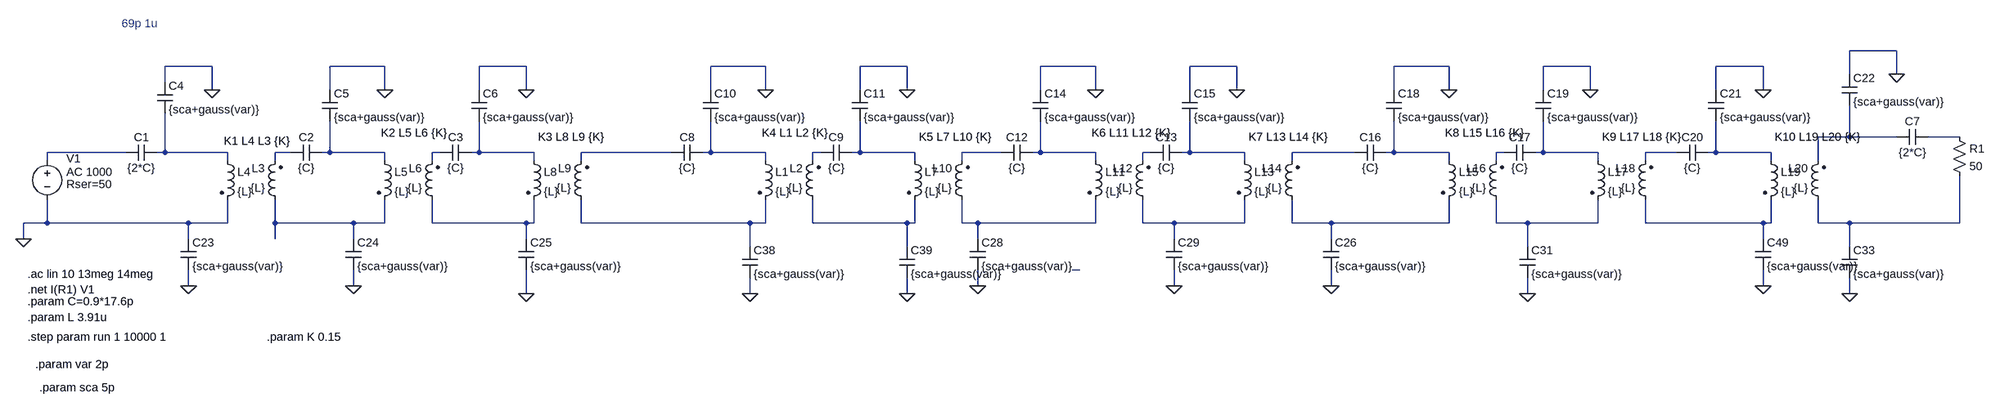
[diagram p0: schematic changeCvalue.asc]
changeCvalue.asc, the LTspice schematic file:
Version 4
SHEET 1 1260 680
WIRE 1072 -80 976 -80
WIRE -2368 -48 -2464 -48
WIRE -2016 -48 -2128 -48
WIRE -1728 -48 -1824 -48
WIRE -1232 -48 -1344 -48
WIRE -944 -48 -1040 -48
WIRE -560 -48 -672 -48
WIRE -272 -48 -368 -48
WIRE 160 -48 48 -48
WIRE 448 -48 352 -48
WIRE 800 -48 704 -48
WIRE 976 -32 976 -80
WIRE 1072 -32 1072 -80
WIRE -2464 -16 -2464 -48
WIRE -2368 0 -2368 -48
WIRE -2128 0 -2128 -48
WIRE -2016 0 -2016 -48
WIRE -1824 0 -1824 -48
WIRE -1728 0 -1728 -48
WIRE -1344 0 -1344 -48
WIRE -1232 0 -1232 -48
WIRE -1040 0 -1040 -48
WIRE -944 0 -944 -48
WIRE -672 0 -672 -48
WIRE -560 0 -560 -48
WIRE -368 0 -368 -48
WIRE -272 0 -272 -48
WIRE 48 0 48 -48
WIRE 160 0 160 -48
WIRE 352 0 352 -48
WIRE 448 0 448 -48
WIRE 704 0 704 -48
WIRE 800 0 800 -48
WIRE 976 96 976 32
WIRE 976 96 912 96
WIRE 1072 96 976 96
WIRE 1200 96 1136 96
WIRE -2544 128 -2704 128
WIRE -2464 128 -2464 48
WIRE -2464 128 -2480 128
WIRE -2336 128 -2464 128
WIRE -2208 128 -2240 128
WIRE -2128 128 -2128 64
WIRE -2128 128 -2144 128
WIRE -2016 128 -2128 128
WIRE -1904 128 -1920 128
WIRE -1824 128 -1824 64
WIRE -1824 128 -1840 128
WIRE -1712 128 -1824 128
WIRE -1424 128 -1616 128
WIRE -1344 128 -1344 64
WIRE -1344 128 -1360 128
WIRE -1232 128 -1344 128
WIRE -1120 128 -1136 128
WIRE -1040 128 -1040 64
WIRE -1040 128 -1056 128
WIRE -928 128 -1040 128
WIRE -752 128 -832 128
WIRE -672 128 -672 64
WIRE -672 128 -688 128
WIRE -560 128 -672 128
WIRE -448 128 -464 128
WIRE -368 128 -368 64
WIRE -368 128 -384 128
WIRE -256 128 -368 128
WIRE -32 128 -160 128
WIRE 48 128 48 64
WIRE 48 128 32 128
WIRE 160 128 48 128
WIRE 272 128 256 128
WIRE 352 128 352 64
WIRE 352 128 336 128
WIRE 464 128 352 128
WIRE 624 128 560 128
WIRE 704 128 704 64
WIRE 704 128 688 128
WIRE 816 128 704 128
WIRE -2704 144 -2704 128
WIRE -2336 144 -2336 128
WIRE -2240 144 -2240 128
WIRE -2016 144 -2016 128
WIRE -1920 144 -1920 128
WIRE -1712 144 -1712 128
WIRE -1616 144 -1616 128
WIRE -1232 144 -1232 128
WIRE -1136 144 -1136 128
WIRE -928 144 -928 128
WIRE -832 144 -832 128
WIRE -560 144 -560 128
WIRE -464 144 -464 128
WIRE -256 144 -256 128
WIRE -160 144 -160 128
WIRE 160 144 160 128
WIRE 256 144 256 128
WIRE 464 144 464 128
WIRE 560 144 560 128
WIRE 816 144 816 128
WIRE 912 144 912 96
WIRE -2704 272 -2704 224
WIRE -2704 272 -2752 272
WIRE -2416 272 -2704 272
WIRE -2336 272 -2336 224
WIRE -2336 272 -2416 272
WIRE -2240 272 -2240 224
WIRE -2080 272 -2240 272
WIRE -2016 272 -2016 224
WIRE -2016 272 -2080 272
WIRE -1920 272 -1920 224
WIRE -1728 272 -1920 272
WIRE -1712 272 -1712 224
WIRE -1712 272 -1728 272
WIRE -1616 272 -1616 224
WIRE -1264 272 -1616 272
WIRE -1232 272 -1232 224
WIRE -1232 272 -1264 272
WIRE -1136 272 -1136 224
WIRE -944 272 -1136 272
WIRE -928 272 -928 224
WIRE -928 272 -944 272
WIRE -832 272 -832 224
WIRE -800 272 -832 272
WIRE -560 272 -560 224
WIRE -560 272 -800 272
WIRE -464 272 -464 224
WIRE -400 272 -464 272
WIRE -256 272 -256 224
WIRE -256 272 -400 272
WIRE -160 272 -160 224
WIRE -80 272 -160 272
WIRE 160 272 160 224
WIRE 160 272 -80 272
WIRE 256 272 256 224
WIRE 320 272 256 272
WIRE 464 272 464 224
WIRE 464 272 320 272
WIRE 560 272 560 224
WIRE 800 272 560 272
WIRE 816 272 816 224
WIRE 816 272 800 272
WIRE 912 272 912 224
WIRE 976 272 912 272
WIRE 1200 272 1200 176
WIRE 1200 272 976 272
WIRE -2752 304 -2752 272
WIRE -2416 304 -2416 272
WIRE -2240 304 -2240 272
WIRE -2080 304 -2080 272
WIRE -1728 304 -1728 272
WIRE -800 304 -800 272
WIRE -400 304 -400 272
WIRE -80 304 -80 272
WIRE 800 304 800 272
WIRE -1264 320 -1264 272
WIRE -944 320 -944 272
WIRE 320 320 320 272
WIRE 976 320 976 272
WIRE -592 368 -608 368
WIRE -2416 400 -2416 368
WIRE -2080 400 -2080 368
WIRE -800 400 -800 368
WIRE -400 400 -400 368
WIRE -80 400 -80 368
WIRE 800 400 800 368
WIRE -1728 416 -1728 368
WIRE -1264 416 -1264 384
WIRE -944 416 -944 384
WIRE 320 416 320 384
WIRE 976 416 976 384
FLAG -2752 304 0
FLAG -2368 0 0
FLAG -2016 0 0
FLAG -1728 0 0
FLAG -1232 0 0
FLAG -944 0 0
FLAG -560 0 0
FLAG -272 0 0
FLAG 160 0 0
FLAG 448 0 0
FLAG 800 0 0
FLAG 1072 -32 0
FLAG -2416 400 0
FLAG -2080 400 0
FLAG -800 400 0
FLAG -400 400 0
FLAG -80 400 0
FLAG 320 416 0
FLAG 976 416 0
FLAG 800 400 0
FLAG -944 416 0
FLAG -1264 416 0
FLAG -1728 416 0
SYMBOL voltage -2704 128 R0
WINDOW 0 39 12 Left 2
WINDOW 123 39 40 Left 2
WINDOW 39 39 65 Left 2
SYMATTR InstName V1
SYMATTR Value2 AC 1000
SYMATTR SpiceLine Rser=50
SYMATTR Value ""
SYMBOL res 1184 80 R0
SYMATTR InstName R1
SYMATTR Value 50
SYMBOL ind2 -2224 240 R180
WINDOW 0 36 80 Left 2
WINDOW 3 36 40 Left 2
SYMATTR InstName L3
SYMATTR Value {L}
SYMATTR Type ind
SYMBOL ind2 -2352 128 R0
SYMATTR InstName L4
SYMATTR Value {L}
SYMATTR Type ind
SYMBOL cap -2480 112 R90
WINDOW 0 0 32 VBottom 2
WINDOW 3 32 32 VTop 2
SYMATTR InstName C1
SYMATTR Value {2*C}
SYMBOL cap -2144 112 R90
WINDOW 0 0 32 VBottom 2
WINDOW 3 32 32 VTop 2
SYMATTR InstName C2
SYMATTR Value {C}
SYMBOL ind2 -2032 128 R0
SYMATTR InstName L5
SYMATTR Value {L}
SYMATTR Type ind
SYMBOL ind2 -1904 240 R180
WINDOW 0 36 80 Left 2
WINDOW 3 36 40 Left 2
SYMATTR InstName L6
SYMATTR Value {L}
SYMATTR Type ind
SYMBOL cap -1840 112 R90
WINDOW 0 0 32 VBottom 2
WINDOW 3 32 32 VTop 2
SYMATTR InstName C3
SYMATTR Value {C}
SYMBOL ind2 -1728 128 R0
SYMATTR InstName L8
SYMATTR Value {L}
SYMATTR Type ind
SYMBOL ind2 -1600 240 R180
WINDOW 0 36 80 Left 2
WINDOW 3 36 40 Left 2
SYMATTR InstName L9
SYMATTR Value {L}
SYMATTR Type ind
SYMBOL cap -2480 -16 R0
SYMATTR InstName C4
SYMATTR Value {sca+gauss(var)}
SYMBOL cap -2144 0 R0
SYMATTR InstName C5
SYMATTR Value {sca+gauss(var)}
SYMBOL cap -1840 0 R0
SYMATTR InstName C6
SYMATTR Value {sca+gauss(var)}
SYMBOL cap 1136 80 R90
WINDOW 0 0 32 VBottom 2
WINDOW 3 32 32 VTop 2
SYMATTR InstName C7
SYMATTR Value {2*C}
SYMBOL cap -1360 112 R90
WINDOW 0 0 32 VBottom 2
WINDOW 3 32 32 VTop 2
SYMATTR InstName C8
SYMATTR Value {C}
SYMBOL ind2 -1248 128 R0
SYMATTR InstName L1
SYMATTR Value {L}
SYMATTR Type ind
SYMBOL ind2 -1120 240 R180
WINDOW 0 36 80 Left 2
WINDOW 3 36 40 Left 2
SYMATTR InstName L2
SYMATTR Value {L}
SYMATTR Type ind
SYMBOL cap -1056 112 R90
WINDOW 0 0 32 VBottom 2
WINDOW 3 32 32 VTop 2
SYMATTR InstName C9
SYMATTR Value {C}
SYMBOL ind2 -944 128 R0
SYMATTR InstName L7
SYMATTR Value {L}
SYMATTR Type ind
SYMBOL ind2 -816 240 R180
WINDOW 0 36 80 Left 2
WINDOW 3 36 40 Left 2
SYMATTR InstName L10
SYMATTR Value {L}
SYMATTR Type ind
SYMBOL cap -1360 0 R0
SYMATTR InstName C10
SYMATTR Value {sca+gauss(var)}
SYMBOL cap -1056 0 R0
SYMATTR InstName C11
SYMATTR Value {sca+gauss(var)}
SYMBOL cap -688 112 R90
WINDOW 0 0 32 VBottom 2
WINDOW 3 32 32 VTop 2
SYMATTR InstName C12
SYMATTR Value {C}
SYMBOL ind2 -576 128 R0
SYMATTR InstName L11
SYMATTR Value {L}
SYMATTR Type ind
SYMBOL ind2 -448 240 R180
WINDOW 0 36 80 Left 2
WINDOW 3 36 40 Left 2
SYMATTR InstName L12
SYMATTR Value {L}
SYMATTR Type ind
SYMBOL cap -384 112 R90
WINDOW 0 0 32 VBottom 2
WINDOW 3 32 32 VTop 2
SYMATTR InstName C13
SYMATTR Value {C}
SYMBOL ind2 -272 128 R0
SYMATTR InstName L13
SYMATTR Value {L}
SYMATTR Type ind
SYMBOL ind2 -144 240 R180
WINDOW 0 36 80 Left 2
WINDOW 3 36 40 Left 2
SYMATTR InstName L14
SYMATTR Value {L}
SYMATTR Type ind
SYMBOL cap -688 0 R0
SYMATTR InstName C14
SYMATTR Value {sca+gauss(var)}
SYMBOL cap -384 0 R0
SYMATTR InstName C15
SYMATTR Value {sca+gauss(var)}
SYMBOL cap 32 112 R90
WINDOW 0 0 32 VBottom 2
WINDOW 3 32 32 VTop 2
SYMATTR InstName C16
SYMATTR Value {C}
SYMBOL ind2 144 128 R0
SYMATTR InstName L15
SYMATTR Value {L}
SYMATTR Type ind
SYMBOL ind2 272 240 R180
WINDOW 0 36 80 Left 2
WINDOW 3 36 40 Left 2
SYMATTR InstName L16
SYMATTR Value {L}
SYMATTR Type ind
SYMBOL cap 336 112 R90
WINDOW 0 0 32 VBottom 2
WINDOW 3 32 32 VTop 2
SYMATTR InstName C17
SYMATTR Value {C}
SYMBOL ind2 448 128 R0
SYMATTR InstName L17
SYMATTR Value {L}
SYMATTR Type ind
SYMBOL ind2 576 240 R180
WINDOW 0 36 80 Left 2
WINDOW 3 36 40 Left 2
SYMATTR InstName L18
SYMATTR Value {L}
SYMATTR Type ind
SYMBOL cap 32 0 R0
SYMATTR InstName C18
SYMATTR Value {sca+gauss(var)}
SYMBOL cap 336 0 R0
SYMATTR InstName C19
SYMATTR Value {sca+gauss(var)}
SYMBOL cap 688 112 R90
WINDOW 0 0 32 VBottom 2
WINDOW 3 32 32 VTop 2
SYMATTR InstName C20
SYMATTR Value {C}
SYMBOL ind2 800 128 R0
SYMATTR InstName L19
SYMATTR Value {L}
SYMATTR Type ind
SYMBOL ind2 928 240 R180
WINDOW 0 36 80 Left 2
WINDOW 3 36 40 Left 2
SYMATTR InstName L20
SYMATTR Value {L}
SYMATTR Type ind
SYMBOL cap 688 0 R0
SYMATTR InstName C21
SYMATTR Value {sca+gauss(var)}
SYMBOL cap 960 -32 R0
SYMATTR InstName C22
SYMATTR Value {sca+gauss(var)}
SYMBOL cap -2432 304 R0
SYMATTR InstName C23
SYMATTR Value {sca+gauss(var)}
SYMBOL cap -2096 304 R0
SYMATTR InstName C24
SYMATTR Value {sca+gauss(var)}
SYMBOL cap -816 304 R0
SYMATTR InstName C28
SYMATTR Value {sca+gauss(var)}
SYMBOL cap 304 320 R0
SYMATTR InstName C31
SYMATTR Value {sca+gauss(var)}
SYMBOL cap 960 320 R0
SYMATTR InstName C33
SYMATTR Value {sca+gauss(var)}
SYMBOL cap -1280 320 R0
SYMATTR InstName C38
SYMATTR Value {sca+gauss(var)}
SYMBOL cap -960 320 R0
SYMATTR InstName C39
SYMATTR Value {sca+gauss(var)}
SYMBOL cap 784 304 R0
SYMATTR InstName C49
SYMATTR Value {sca+gauss(var)}
SYMBOL cap -1744 304 R0
SYMATTR InstName C25
SYMATTR Value {sca+gauss(var)}
SYMBOL cap -96 304 R0
SYMATTR InstName C26
SYMATTR Value {sca+gauss(var)}
SYMBOL cap -416 304 R0
SYMATTR InstName C29
SYMATTR Value {sca+gauss(var)}
TEXT -2744 376 Left 2 !.ac lin 10 13meg 14meg
TEXT -2744 408 Left 2 !.net I(R1) V1
TEXT -2344 104 Left 2 !K1 L4 L3 {K}
TEXT -2744 432 Left 2 !.param C=0.9*17.6p
TEXT -2744 464 Left 2 !.param L 3.91u
TEXT -2024 88 Left 2 !K2 L5 L6 {K}
TEXT -1704 96 Left 2 !K3 L8 L9 {K}
TEXT -2744 504 Left 2 !.step param run 1 10000 1
TEXT -2256 504 Left 2 !.param K 0.15
TEXT -1240 88 Left 2 !K4 L1 L2 {K}
TEXT -920 96 Left 2 !K5 L7 L10 {K}
TEXT -568 88 Left 2 !K6 L11 L12 {K}
TEXT -248 96 Left 2 !K7 L13 L14 {K}
TEXT 152 88 Left 2 !K8 L15 L16 {K}
TEXT 472 96 Left 2 !K9 L17 L18 {K}
TEXT 824 96 Left 2 !K10 L19 L20 {K}
TEXT -2552 -136 Left 2 ;69p 1u
TEXT -2728 560 Left 2 !.param var 2p
TEXT -2720 608 Left 2 !.param sca 5p

The netlist it stands for:
* changeCvalue.asc
V1 N003 0 AC 1000 Rser=50
R1 N002 N032 50
L3 N023 N005 {L}
L4 N004 0 {L}
C1 N004 N003 {2*C}
C2 N006 N005 {C}
L5 N006 N023 {L}
L6 N024 N007 {L}
C3 N008 N007 {C}
L8 N008 N024 {L}
L9 N025 N009 {L}
C4 0 N004 {sca+gauss(var)}
C5 0 N006 {sca+gauss(var)}
C6 0 N008 {sca+gauss(var)}
C7 N002 N001 {2*C}
C8 N010 N009 {C}
L1 N010 N025 {L}
L2 N026 N011 {L}
C9 N012 N011 {C}
L7 N012 N026 {L}
L10 N027 N013 {L}
C10 0 N010 {sca+gauss(var)}
C11 0 N012 {sca+gauss(var)}
C12 N014 N013 {C}
L11 N014 N027 {L}
L12 N028 N015 {L}
C13 N016 N015 {C}
L13 N016 N028 {L}
L14 N029 N017 {L}
C14 0 N014 {sca+gauss(var)}
C15 0 N016 {sca+gauss(var)}
C16 N018 N017 {C}
L15 N018 N029 {L}
L16 N030 N019 {L}
C17 N020 N019 {C}
L17 N020 N030 {L}
L18 N031 N021 {L}
C18 0 N018 {sca+gauss(var)}
C19 0 N020 {sca+gauss(var)}
C20 N022 N021 {C}
L19 N022 N031 {L}
L20 N032 N001 {L}
C21 0 N022 {sca+gauss(var)}
C22 0 N001 {sca+gauss(var)}
C23 0 0 {sca+gauss(var)}
C24 N023 0 {sca+gauss(var)}
C28 N027 0 {sca+gauss(var)}
C31 N030 0 {sca+gauss(var)}
C33 N032 0 {sca+gauss(var)}
C38 N025 0 {sca+gauss(var)}
C39 N026 0 {sca+gauss(var)}
C49 N031 0 {sca+gauss(var)}
C25 N024 0 {sca+gauss(var)}
C26 N029 0 {sca+gauss(var)}
C29 N028 0 {sca+gauss(var)}
.ac lin 10 13meg 14meg
.net I(R1) V1
K1 L4 L3 {K}
.param C=0.9*17.6p
.param L 3.91u
K2 L5 L6 {K}
K3 L8 L9 {K}
.step param run 1 10000 1
.param K 0.15
K4 L1 L2 {K}
K5 L7 L10 {K}
K6 L11 L12 {K}
K7 L13 L14 {K}
K8 L15 L16 {K}
K9 L17 L18 {K}
K10 L19 L20 {K}
* 69p 1u
.param var 2p
.param sca 5p
.backanno
.end